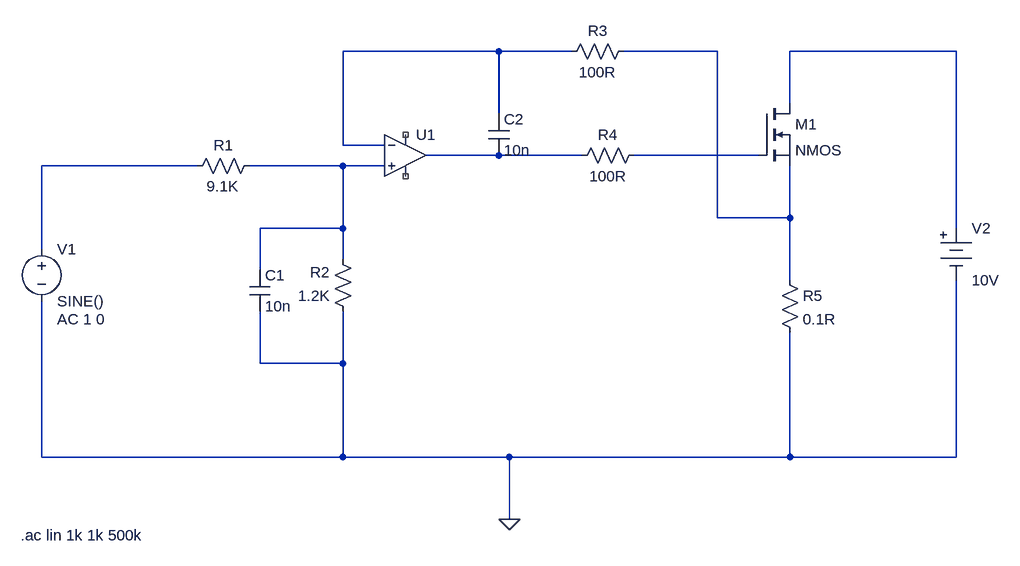
[diagram p0: schematic Draft1.asc]
Draft1.asc, the LTspice schematic file:
Version 4
SHEET 1 1144 836
WIRE 224 0 -16 0
WIRE 336 0 224 0
WIRE 560 0 416 0
WIRE 928 0 672 0
WIRE 672 80 672 0
WIRE 224 96 224 0
WIRE -16 144 -16 0
WIRE 48 144 -16 144
WIRE 224 160 112 160
WIRE 352 160 224 160
WIRE 624 160 432 160
WIRE -240 176 -480 176
WIRE -16 176 -160 176
WIRE 48 176 -16 176
WIRE 560 256 560 0
WIRE 672 256 672 176
WIRE 672 256 560 256
WIRE -16 272 -16 176
WIRE -16 272 -144 272
WIRE 928 272 928 0
WIRE -480 304 -480 176
WIRE -16 320 -16 272
WIRE -144 336 -144 272
WIRE 672 352 672 256
WIRE -144 480 -144 400
WIRE -16 480 -16 400
WIRE -16 480 -144 480
WIRE -480 624 -480 384
WIRE -16 624 -16 480
WIRE -16 624 -480 624
WIRE 240 624 -16 624
WIRE 672 624 672 432
WIRE 672 624 240 624
WIRE 928 624 928 352
WIRE 928 624 672 624
WIRE 240 720 240 624
FLAG 240 720 0
SYMBOL res -144 160 R90
WINDOW 0 0 56 VBottom 2
WINDOW 3 32 57 VTop 2
SYMATTR InstName R1
SYMATTR Value 9.1K
SYMBOL res 0 416 R180
WINDOW 0 36 76 Left 2
WINDOW 3 36 40 Left 2
SYMATTR InstName R2
SYMATTR Value 1.2K
SYMBOL res 320 16 R270
WINDOW 0 32 56 VTop 2
WINDOW 3 0 56 VBottom 2
SYMATTR InstName R3
SYMATTR Value 100R
SYMBOL res 448 144 R90
WINDOW 0 0 56 VBottom 2
WINDOW 3 32 56 VTop 2
SYMATTR InstName R4
SYMATTR Value 100R
SYMBOL cap -160 336 R0
SYMATTR InstName C1
SYMATTR Value 10n
SYMBOL cap 208 96 R0
SYMATTR InstName C2
SYMATTR Value 10n
SYMBOL voltage -480 288 R0
WINDOW 123 24 124 Left 2
WINDOW 39 0 0 Left 0
SYMATTR Value2 AC 1 0
SYMATTR InstName V1
SYMATTR Value SINE()
SYMBOL nmos 624 80 R0
SYMATTR InstName M1
SYMBOL res 656 336 R0
SYMATTR InstName R5
SYMATTR Value 0.1R
SYMBOL Misc\\battery 928 256 R0
SYMATTR InstName V2
SYMATTR Value 10V
SYMBOL OpAmps\\UniversalOpAmp 80 160 R0
SYMATTR InstName U1
TEXT -512 744 Left 2 !.ac lin 1k 1k 500k

The netlist it stands for:
* Draft1.asc
R1 N007 N006 9.1K
R2 0 N007 1.2K
R3 N001 N002 100R
R4 N005 N004 100R
C1 N007 0 10n
C2 N001 N004 10n
V1 N006 0 SINE() AC 1 0
M1 N003 N005 N002 N002 NMOS
R5 N002 0 0.1R
V2 N003 0 10V
XU1 N007 N001 NC_01 NC_02 N004 level1 Avol=1Meg GBW=10Meg Vos=0 En=0 Enk=0 In=0 Ink=0 Rin=500Meg  ; pins In+ In- V+ V- OUT
.model NMOS NMOS
.model PMOS PMOS
.lib standard.mos
.ac lin 1k 1k 500k
.lib UniversalOpAmp1.lib
.backanno
.end